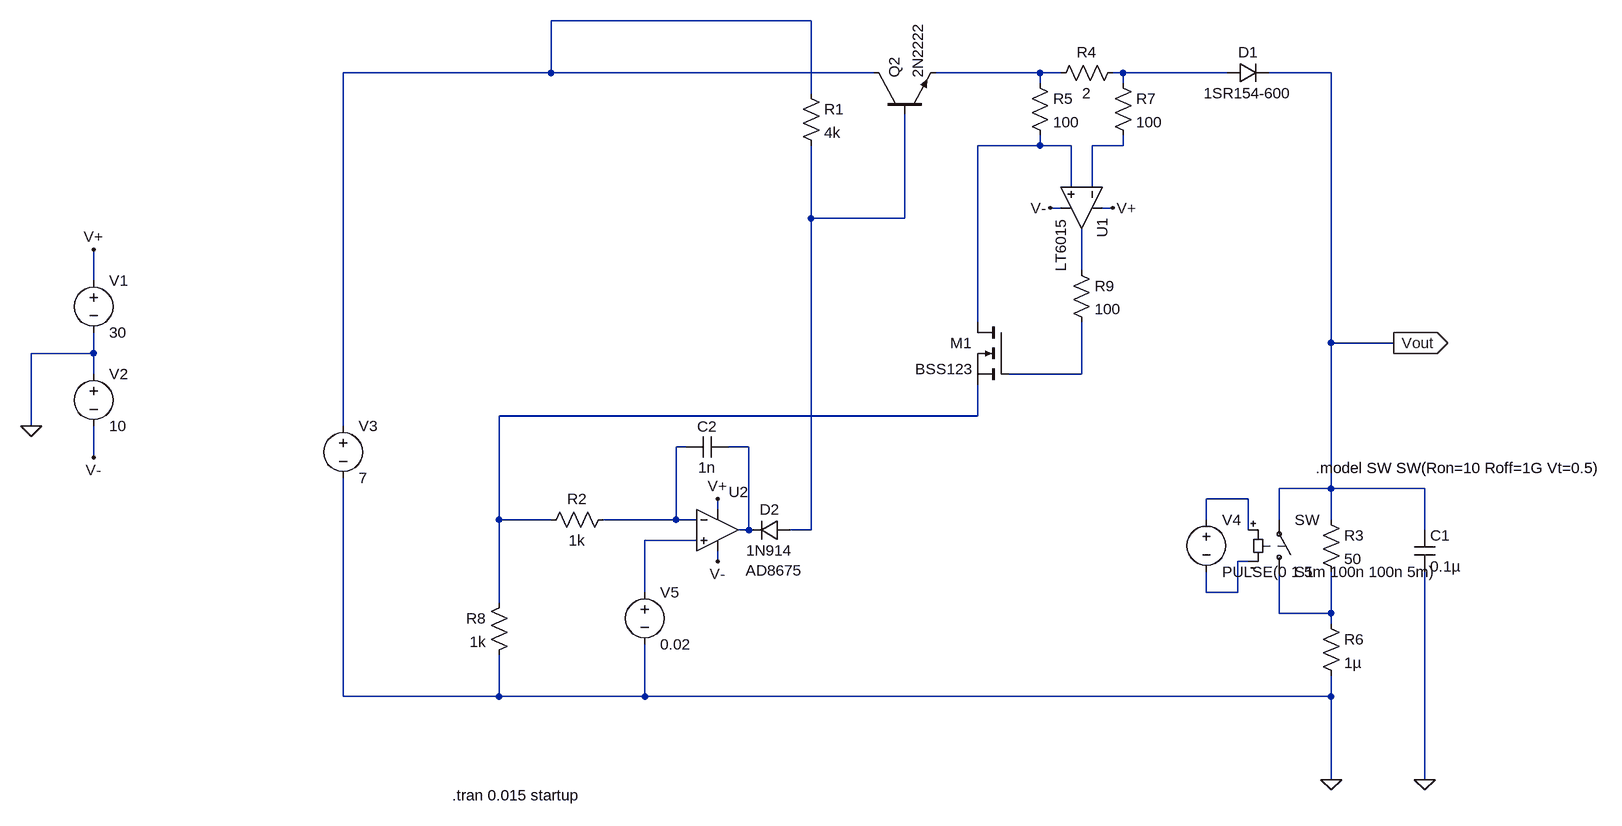
[diagram p0: schematic high_side_current_sense_3.asc]
high_side_current_sense_3.asc, the LTspice schematic file:
Version 4
SHEET 1 1780 1284
WIRE 528 -48 128 -48
WIRE 128 32 128 -48
WIRE 128 32 -192 32
WIRE 624 32 128 32
WIRE 880 32 720 32
WIRE 912 32 880 32
WIRE 1008 32 992 32
WIRE 1168 32 1008 32
WIRE 1328 32 1232 32
WIRE 880 48 880 32
WIRE 1008 48 1008 32
WIRE 528 64 528 -48
WIRE 880 144 880 128
WIRE 880 144 784 144
WIRE 928 144 880 144
WIRE 1008 144 1008 128
WIRE 1008 144 960 144
WIRE 928 208 928 144
WIRE 960 208 960 144
WIRE 912 240 896 240
WIRE 992 240 976 240
WIRE 528 256 528 144
WIRE 672 256 672 96
WIRE 672 256 528 256
WIRE 944 336 944 272
WIRE -576 352 -576 304
WIRE 784 416 784 144
WIRE 1328 448 1328 32
WIRE 1424 448 1328 448
WIRE -576 464 -576 432
WIRE -576 464 -672 464
WIRE -576 496 -576 464
WIRE 944 496 944 416
WIRE 944 496 832 496
WIRE 784 560 784 512
WIRE 784 560 48 560
WIRE -672 576 -672 464
WIRE -192 576 -192 32
WIRE 336 608 320 608
WIRE 432 608 400 608
WIRE -576 624 -576 576
WIRE 1328 672 1328 448
WIRE 1328 672 1248 672
WIRE 1472 672 1328 672
WIRE 1200 688 1136 688
WIRE 384 704 384 688
WIRE 48 720 48 560
WIRE 128 720 48 720
WIRE 320 720 320 608
WIRE 320 720 208 720
WIRE 352 720 320 720
WIRE 1136 720 1136 688
WIRE 1248 720 1248 672
WIRE 1328 720 1328 672
WIRE 432 736 432 608
WIRE 432 736 416 736
WIRE 528 736 528 256
WIRE 528 736 496 736
WIRE 1200 736 1200 688
WIRE 1472 736 1472 672
WIRE 352 752 272 752
WIRE 384 784 384 768
WIRE 1200 784 1184 784
WIRE 272 832 272 752
WIRE 1136 832 1136 800
WIRE 1184 832 1184 784
WIRE 1184 832 1136 832
WIRE 48 848 48 720
WIRE 1248 864 1248 800
WIRE 1328 864 1328 800
WIRE 1328 864 1248 864
WIRE 1328 880 1328 864
WIRE -192 992 -192 656
WIRE 48 992 48 928
WIRE 48 992 -192 992
WIRE 272 992 272 912
WIRE 272 992 48 992
WIRE 1328 992 1328 960
WIRE 1328 992 272 992
WIRE 1328 1120 1328 992
WIRE 1472 1120 1472 800
FLAG -576 304 V+
FLAG -576 624 V-
FLAG 1424 448 Vout
IOPIN 1424 448 Out
FLAG 1328 1120 0
FLAG -672 576 0
FLAG 384 688 V+
FLAG 384 784 V-
FLAG 992 240 V+
FLAG 896 240 V-
FLAG 1472 1120 0
SYMBOL voltage -576 336 R0
WINDOW 123 0 0 Left 0
WINDOW 39 0 0 Left 0
SYMATTR InstName V1
SYMATTR Value 30
SYMBOL voltage -576 480 R0
WINDOW 123 0 0 Left 0
WINDOW 39 0 0 Left 0
SYMATTR InstName V2
SYMATTR Value 10
SYMBOL voltage -192 560 R0
WINDOW 123 0 0 Left 0
WINDOW 39 0 0 Left 0
SYMATTR InstName V3
SYMATTR Value 7
SYMBOL npn 624 96 R270
SYMATTR InstName Q2
SYMATTR Value 2N2222
SYMBOL Opamps\\AD8675 384 672 R0
WINDOW 0 17 5 Left 2
WINDOW 3 43 126 Left 2
SYMATTR InstName U2
SYMBOL diode 496 752 M270
WINDOW 0 32 32 VTop 2
WINDOW 3 0 32 VBottom 2
SYMATTR InstName D2
SYMATTR Value 1N914
SYMBOL voltage 272 816 R0
WINDOW 123 0 0 Left 0
WINDOW 39 0 0 Left 0
SYMATTR InstName V5
SYMATTR Value 0.02
SYMBOL res 1312 704 R0
SYMATTR InstName R3
SYMATTR Value 50
SYMBOL res 512 48 R0
SYMATTR InstName R1
SYMATTR Value 4k
SYMBOL res 896 48 R270
WINDOW 0 32 56 VTop 2
WINDOW 3 0 56 VBottom 2
SYMATTR InstName R4
SYMATTR Value 2
SYMBOL Opamps\\LT6015 944 240 R90
SYMATTR InstName U1
SYMBOL res 864 32 R0
SYMATTR InstName R5
SYMATTR Value 100
SYMBOL res 992 32 R0
SYMATTR InstName R7
SYMATTR Value 100
SYMBOL nmos 832 416 M0
SYMATTR InstName M1
SYMATTR Value BSS123
SYMBOL res 64 832 M0
SYMATTR InstName R8
SYMATTR Value 1k
SYMBOL res 928 320 R0
SYMATTR InstName R9
SYMATTR Value 100
SYMBOL cap 1456 736 R0
SYMATTR InstName C1
SYMATTR Value 0.1µ
SYMBOL res 112 736 R270
WINDOW 0 32 56 VTop 2
WINDOW 3 0 56 VBottom 2
SYMATTR InstName R2
SYMATTR Value 1k
SYMBOL cap 336 592 M90
WINDOW 0 0 32 VBottom 2
WINDOW 3 32 32 VTop 2
SYMATTR InstName C2
SYMATTR Value 1n
SYMBOL diode 1168 48 R270
WINDOW 0 32 32 VTop 2
WINDOW 3 0 32 VBottom 2
SYMATTR InstName D1
SYMATTR Value 1SR154-600
SYMBOL sw 1248 816 M180
SYMATTR InstName S1
SYMBOL voltage 1136 704 R0
WINDOW 123 0 0 Left 0
WINDOW 39 0 0 Left 0
SYMATTR InstName V4
SYMATTR Value PULSE(0 1 5m 100n 100n 5m)
SYMBOL res 1312 864 R0
SYMATTR InstName R6
SYMATTR Value 1µ
TEXT -24 1144 Left 2 !.tran 0.015 startup
TEXT 1304 640 Left 2 !.model SW SW(Ron=10 Roff=1G Vt=0.5)

The netlist it stands for:
* high_side_current_sense_3.asc
V1 V+ 0 30
V2 0 V- 10
V3 N001 0 7
Q2 N001 N006 N002 0 2N2222
XU2 N013 N010 V+ V- N011 AD8675  ; pins In+ In- V+ V- OUT
D2 N006 N011 1N914
V5 N013 0 0.02
R3 Vout N015 50
R1 N001 N006 4k
R4 N002 N003 2
XU1 N004 N005 V+ V- N007 LT6016  ; LT6015, pins In+ In- V+ V- OUT
R5 N002 N004 100
R7 N003 N005 100
M1 N004 N008 N009 N009 BSS123
R8 N009 0 1k
R9 N007 N008 100
C1 Vout 0 0.1µ
R2 N009 N010 1k
C2 N010 N011 1n
D1 N003 Vout 1SR154-600
S1 N015 Vout N012 N014 SW
V4 N012 N014 PULSE(0 1 5m 100n 100n 5m)
R6 N015 0 1µ
.model D D
.lib standard.dio
.model NPN NPN
.model PNP PNP
.lib standard.bjt
.model NMOS NMOS
.model PMOS PMOS
.lib standard.mos
.tran 0.015 startup
.model SW SW(Ron=10 Roff=1G Vt=0.5)
.lib LTC2.lib
.backanno
.end